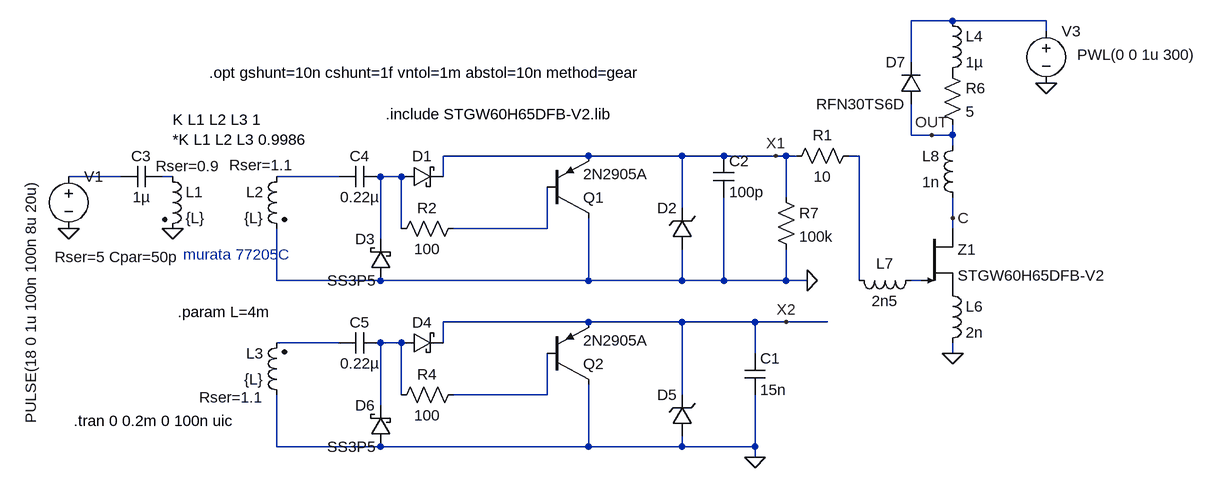
[diagram p0: schematic transformer_driver_AB.asc]
transformer_driver_AB.asc, the LTspice schematic file:
Version 4
SHEET 1 1748 680
WIRE 1280 -176 1216 -176
WIRE 1424 -176 1280 -176
WIRE 1424 -160 1424 -176
WIRE 1216 -112 1216 -176
WIRE 1216 0 1216 -48
WIRE 1248 0 1216 0
WIRE 1280 0 1280 -16
WIRE 1280 0 1248 0
WIRE 1280 16 1280 0
WIRE 720 32 496 32
WIRE 864 32 720 32
WIRE 928 32 864 32
WIRE 1008 32 928 32
WIRE 1024 32 1008 32
WIRE 1040 32 1024 32
WIRE 1136 32 1120 32
WIRE 0 64 -80 64
WIRE 80 64 64 64
WIRE 336 64 240 64
WIRE 432 64 400 64
WIRE 496 64 496 32
WIRE 1024 96 1024 32
WIRE 864 112 864 32
WIRE 1280 128 1280 96
WIRE 432 144 432 64
WIRE 656 144 656 80
WIRE 656 144 512 144
WIRE 1280 144 1280 128
WIRE 400 160 400 64
WIRE 240 224 240 144
WIRE 400 224 240 224
WIRE 720 224 720 128
WIRE 720 224 400 224
WIRE 864 224 864 176
WIRE 864 224 720 224
WIRE 928 224 928 96
WIRE 928 224 864 224
WIRE 1024 224 1024 176
WIRE 1024 224 928 224
WIRE 1056 224 1024 224
WIRE 1136 224 1136 32
WIRE 1232 224 1216 224
WIRE 720 288 496 288
WIRE 864 288 720 288
WIRE 976 288 864 288
WIRE 1024 288 976 288
WIRE 1088 288 1024 288
WIRE 336 320 240 320
WIRE 432 320 400 320
WIRE 496 320 496 288
WIRE 976 336 976 288
WIRE 1280 336 1280 320
WIRE 432 400 432 320
WIRE 656 400 656 336
WIRE 656 400 512 400
WIRE 864 400 864 288
WIRE 400 416 400 320
WIRE 240 480 240 400
WIRE 400 480 240 480
WIRE 720 480 720 384
WIRE 720 480 400 480
WIRE 864 480 864 464
WIRE 864 480 720 480
WIRE 976 480 976 400
WIRE 976 480 864 480
WIRE 976 496 976 480
FLAG 80 144 0
FLAG 1056 224 0
FLAG 976 496 0
FLAG 1280 336 0
FLAG 1424 -80 0
FLAG -80 144 0
FLAG 1248 0 OUT
FLAG 1280 128 C
FLAG 1008 32 X1
FLAG 1024 288 X2
SYMBOL ind2 64 48 R0
WINDOW 39 -10 0 Left 2
SYMATTR SpiceLine Rser=0.9
SYMATTR InstName L1
SYMATTR Value {L}
SYMATTR Type ind
SYMBOL ind2 256 48 M0
WINDOW 39 -10 -2 Left 2
SYMATTR SpiceLine Rser=1.1
SYMATTR InstName L2
SYMATTR Value {L}
SYMATTR Type ind
SYMBOL voltage -80 48 R0
WINDOW 3 -58 18 VRight 2
WINDOW 123 0 0 Left 2
WINDOW 39 -21 140 Left 2
SYMATTR Value PULSE(18 0 1u 100n 100n 8u 20u)
SYMATTR SpiceLine Rser=5 Cpar=50p
SYMATTR InstName V1
SYMBOL schottky 432 80 R270
WINDOW 0 32 32 VTop 2
WINDOW 3 0 32 Invisible 2
SYMATTR InstName D1
SYMATTR Value SS3P5
SYMATTR Description Diode
SYMATTR Type diode
SYMBOL res 528 128 R90
WINDOW 0 0 56 VBottom 2
WINDOW 3 32 56 VTop 2
SYMATTR InstName R2
SYMATTR Value 100
SYMBOL pnp 656 128 M180
SYMATTR InstName Q1
SYMATTR Value 2N2905A
SYMBOL zener 880 176 R180
WINDOW 0 24 64 Left 2
WINDOW 3 24 0 Invisible 2
SYMATTR InstName D2
SYMATTR Value EDZV20B
SYMATTR Description Diode
SYMATTR Type diode
SYMBOL ind2 256 416 R180
WINDOW 0 36 80 Left 2
WINDOW 3 36 40 Left 2
WINDOW 39 36 12 Left 2
SYMATTR InstName L3
SYMATTR Value {L}
SYMATTR SpiceLine Rser=1.1
SYMATTR Type ind
SYMBOL schottky 432 336 R270
WINDOW 0 32 32 VTop 2
WINDOW 3 0 32 Invisible 2
SYMATTR InstName D4
SYMATTR Value RB400VA-50
SYMATTR Description Diode
SYMATTR Type diode
SYMBOL res 528 384 R90
WINDOW 0 0 56 VBottom 2
WINDOW 3 32 56 VTop 2
SYMATTR InstName R4
SYMATTR Value 100
SYMBOL pnp 656 384 M180
SYMATTR InstName Q2
SYMATTR Value 2N2905A
SYMBOL zener 880 464 R180
WINDOW 0 24 64 Left 2
WINDOW 3 24 0 Invisible 2
SYMATTR InstName D5
SYMATTR Value BZX84B20VL
SYMATTR Description Diode
SYMATTR Type diode
SYMBOL ind 1264 -192 R0
SYMATTR InstName L4
SYMATTR Value 1µ
SYMATTR SpiceLine Rser=100m Rpar=10k
SYMBOL res 1264 -112 R0
SYMATTR InstName R6
SYMATTR Value 5
SYMBOL voltage 1424 -176 R0
WINDOW 3 48 52 Left 2
WINDOW 123 0 0 Left 2
WINDOW 39 0 0 Left 2
SYMATTR Value PWL(0 0 1u 300)
SYMATTR InstName V3
SYMBOL diode 1232 -48 R180
WINDOW 0 24 64 Left 2
WINDOW 3 24 0 Left 2
SYMATTR InstName D7
SYMATTR Value RFN30TS6D
SYMBOL ind 1264 224 R0
SYMATTR InstName L6
SYMATTR Value 2n
SYMATTR SpiceLine Rpar=100
SYMBOL ind 1232 208 R90
WINDOW 0 5 56 VBottom 2
WINDOW 3 32 56 VTop 2
SYMATTR InstName L7
SYMATTR Value 2n5
SYMATTR SpiceLine Rpar=100
SYMBOL ind 1296 112 R180
WINDOW 0 36 80 Left 2
WINDOW 3 36 40 Left 2
SYMATTR InstName L8
SYMATTR Value 1n
SYMATTR SpiceLine Rpar=100
SYMBOL cap 960 336 R0
SYMATTR InstName C1
SYMATTR Value 15n
SYMBOL cap 912 32 R0
SYMATTR InstName C2
SYMATTR Value 100p
SYMBOL res 1008 80 R0
SYMATTR InstName R7
SYMATTR Value 100k
SYMBOL cap 64 48 R90
WINDOW 0 0 32 VBottom 2
WINDOW 3 32 32 VTop 2
SYMATTR InstName C3
SYMATTR Value 1µ
SYMBOL cap 400 48 R90
WINDOW 0 0 32 VBottom 2
WINDOW 3 32 32 VTop 2
SYMATTR InstName C4
SYMATTR Value 0.22µ
SYMBOL cap 400 304 R90
WINDOW 0 0 32 VBottom 2
WINDOW 3 32 32 VTop 2
SYMATTR InstName C5
SYMATTR Value 0.22µ
SYMBOL Misc\\NIGBT 1232 144 R0
SYMATTR InstName Z1
SYMATTR Value STGW60H65DFB-V2
SYMATTR Prefix X
SYMBOL schottky 416 224 R180
WINDOW 0 24 64 Left 2
WINDOW 3 24 0 Left 2
SYMATTR InstName D3
SYMATTR Value SS3P5
SYMATTR Description Diode
SYMATTR Type diode
SYMBOL schottky 416 480 R180
WINDOW 0 24 64 Left 2
WINDOW 3 24 0 Left 2
SYMATTR InstName D6
SYMATTR Value SS3P5
SYMATTR Description Diode
SYMATTR Type diode
SYMBOL res 1136 16 R90
WINDOW 0 0 56 VBottom 2
WINDOW 3 32 56 VTop 2
SYMATTR InstName R1
SYMATTR Value 10
TEXT 80 -24 Left 2 !K L1 L2 L3 1\n*K L1 L2 L3 0.9986
TEXT -72 440 Left 2 !.tran 0 0.2m 0 100n uic
TEXT 88 272 Left 2 !.param L=4m
TEXT 96 184 Left 2 ;murata 77205C
TEXT 408 -32 Left 2 !.include STGW60H65DFB-V2.lib
TEXT 136 -96 Left 2 !.opt gshunt=10n cshunt=1f vntol=1m abstol=10n method=gear

The netlist it stands for:
* transformer_driver_AB.asc
L1 N004 0 {L} Rser=0.9
L2 N005 0 {L} Rser=1.1
V1 N003 0 PULSE(18 0 1u 100n 100n 8u 20u) Rser=5 Cpar=50p
D1 N006 X1 SS3P5
R2 N007 N006 100
Q1 0 N007 X1 0 2N2905A
D2 0 X1 EDZV20B
L3 0 N009 {L} Rser=1.1
D4 N010 X2 RB400VA-50
R4 N011 N010 100
Q2 0 N011 X2 0 2N2905A
D5 0 X2 BZX84B20VL
L4 N001 P001 1µ Rser=100m Rpar=10k
R6 P001 OUT 5
V3 N001 0 PWL(0 0 1u 300)
D7 OUT N001 RFN30TS6D
L6 P002 0 2n Rpar=100
L7 N008 N002 2n5 Rpar=100
L8 C OUT 1n Rpar=100
C1 X2 0 15n
C2 X1 0 100p
R7 X1 0 100k
C3 N004 N003 1µ
C4 N006 N005 0.22µ
C5 N010 N009 0.22µ
XZ1 C N008 P002 STGW60H65DFB-V2  ; pins C G E
D3 0 N006 SS3P5
D6 0 N010 SS3P5
R1 N002 X1 10
.model D D
.lib standard.dio
.model NPN NPN
.model PNP PNP
.lib standard.bjt
K L1 L2 L3 1
*K L1 L2 L3 0.9986
.tran 0 0.2m 0 100n uic
.param L=4m
* murata 77205C
.include STGW60H65DFB-V2.lib
.opt gshunt=10n cshunt=1f vntol=1m abstol=10n method=gear
.backanno
.end